# EAGLE schematic borrador_1 (EAGLE 9.5.2)

## Sheet 1 of 2
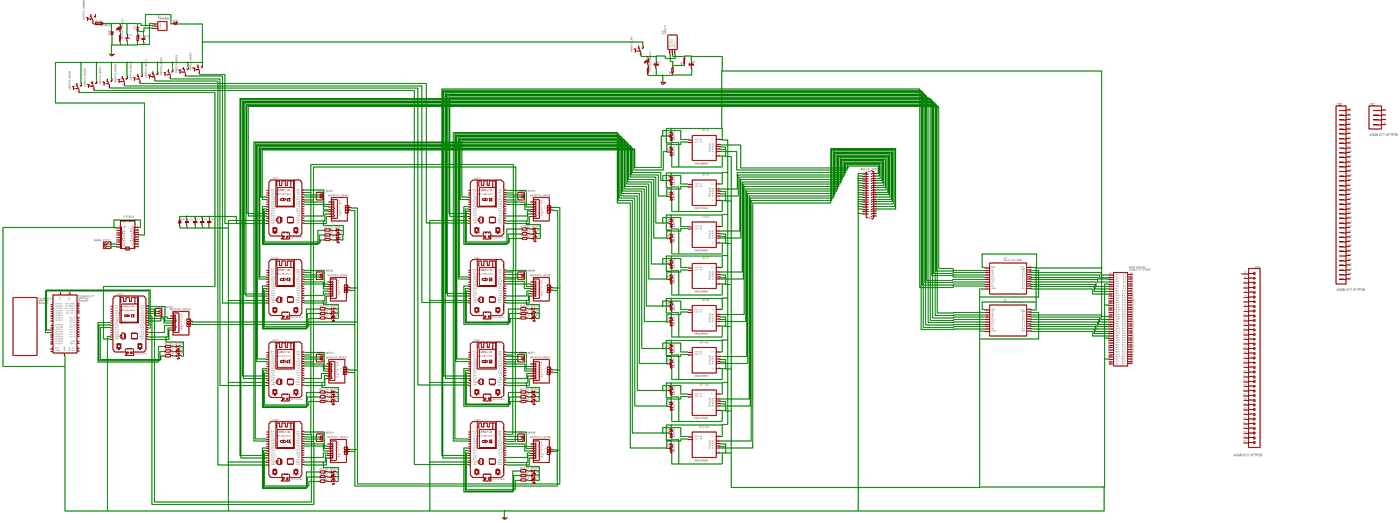
[diagram p0: schematic, sheet 1, overview]
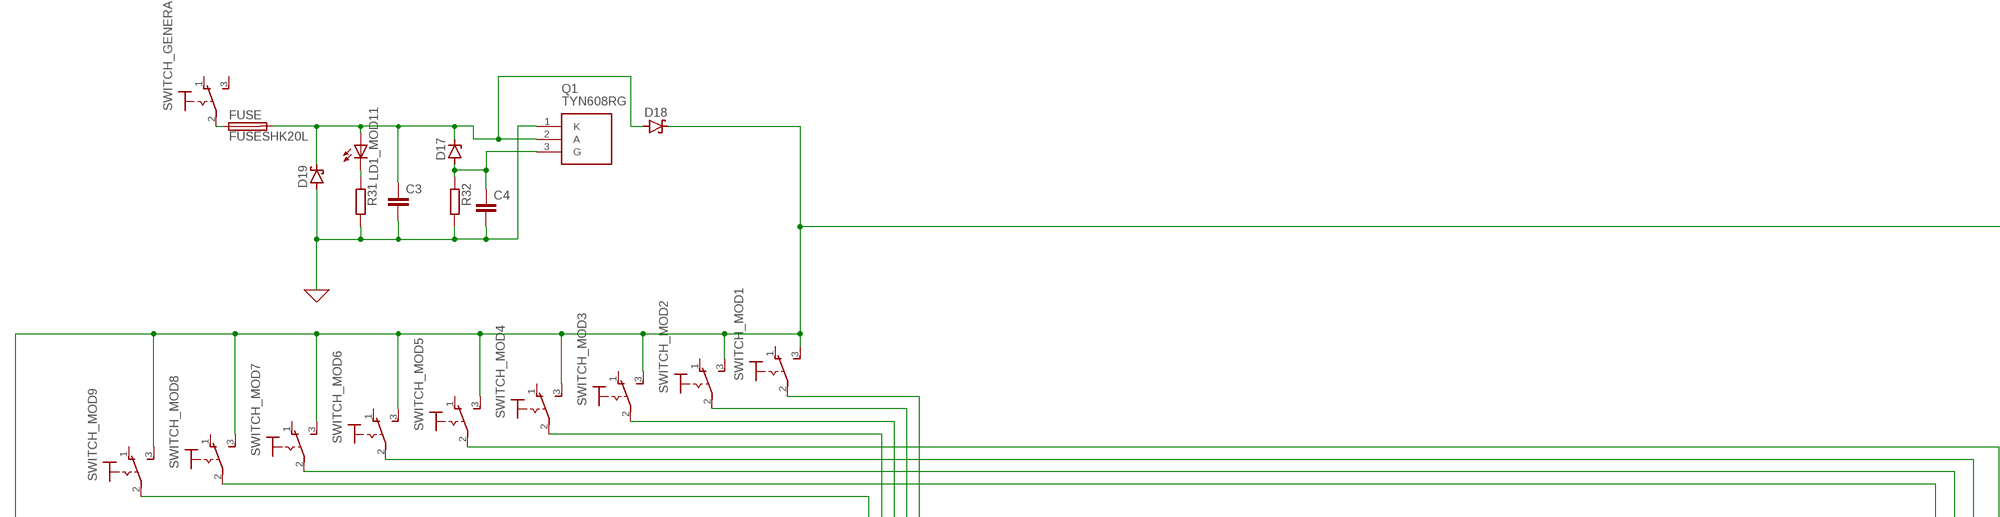
[diagram p1: schematic, sheet 1, part 1 of 9]
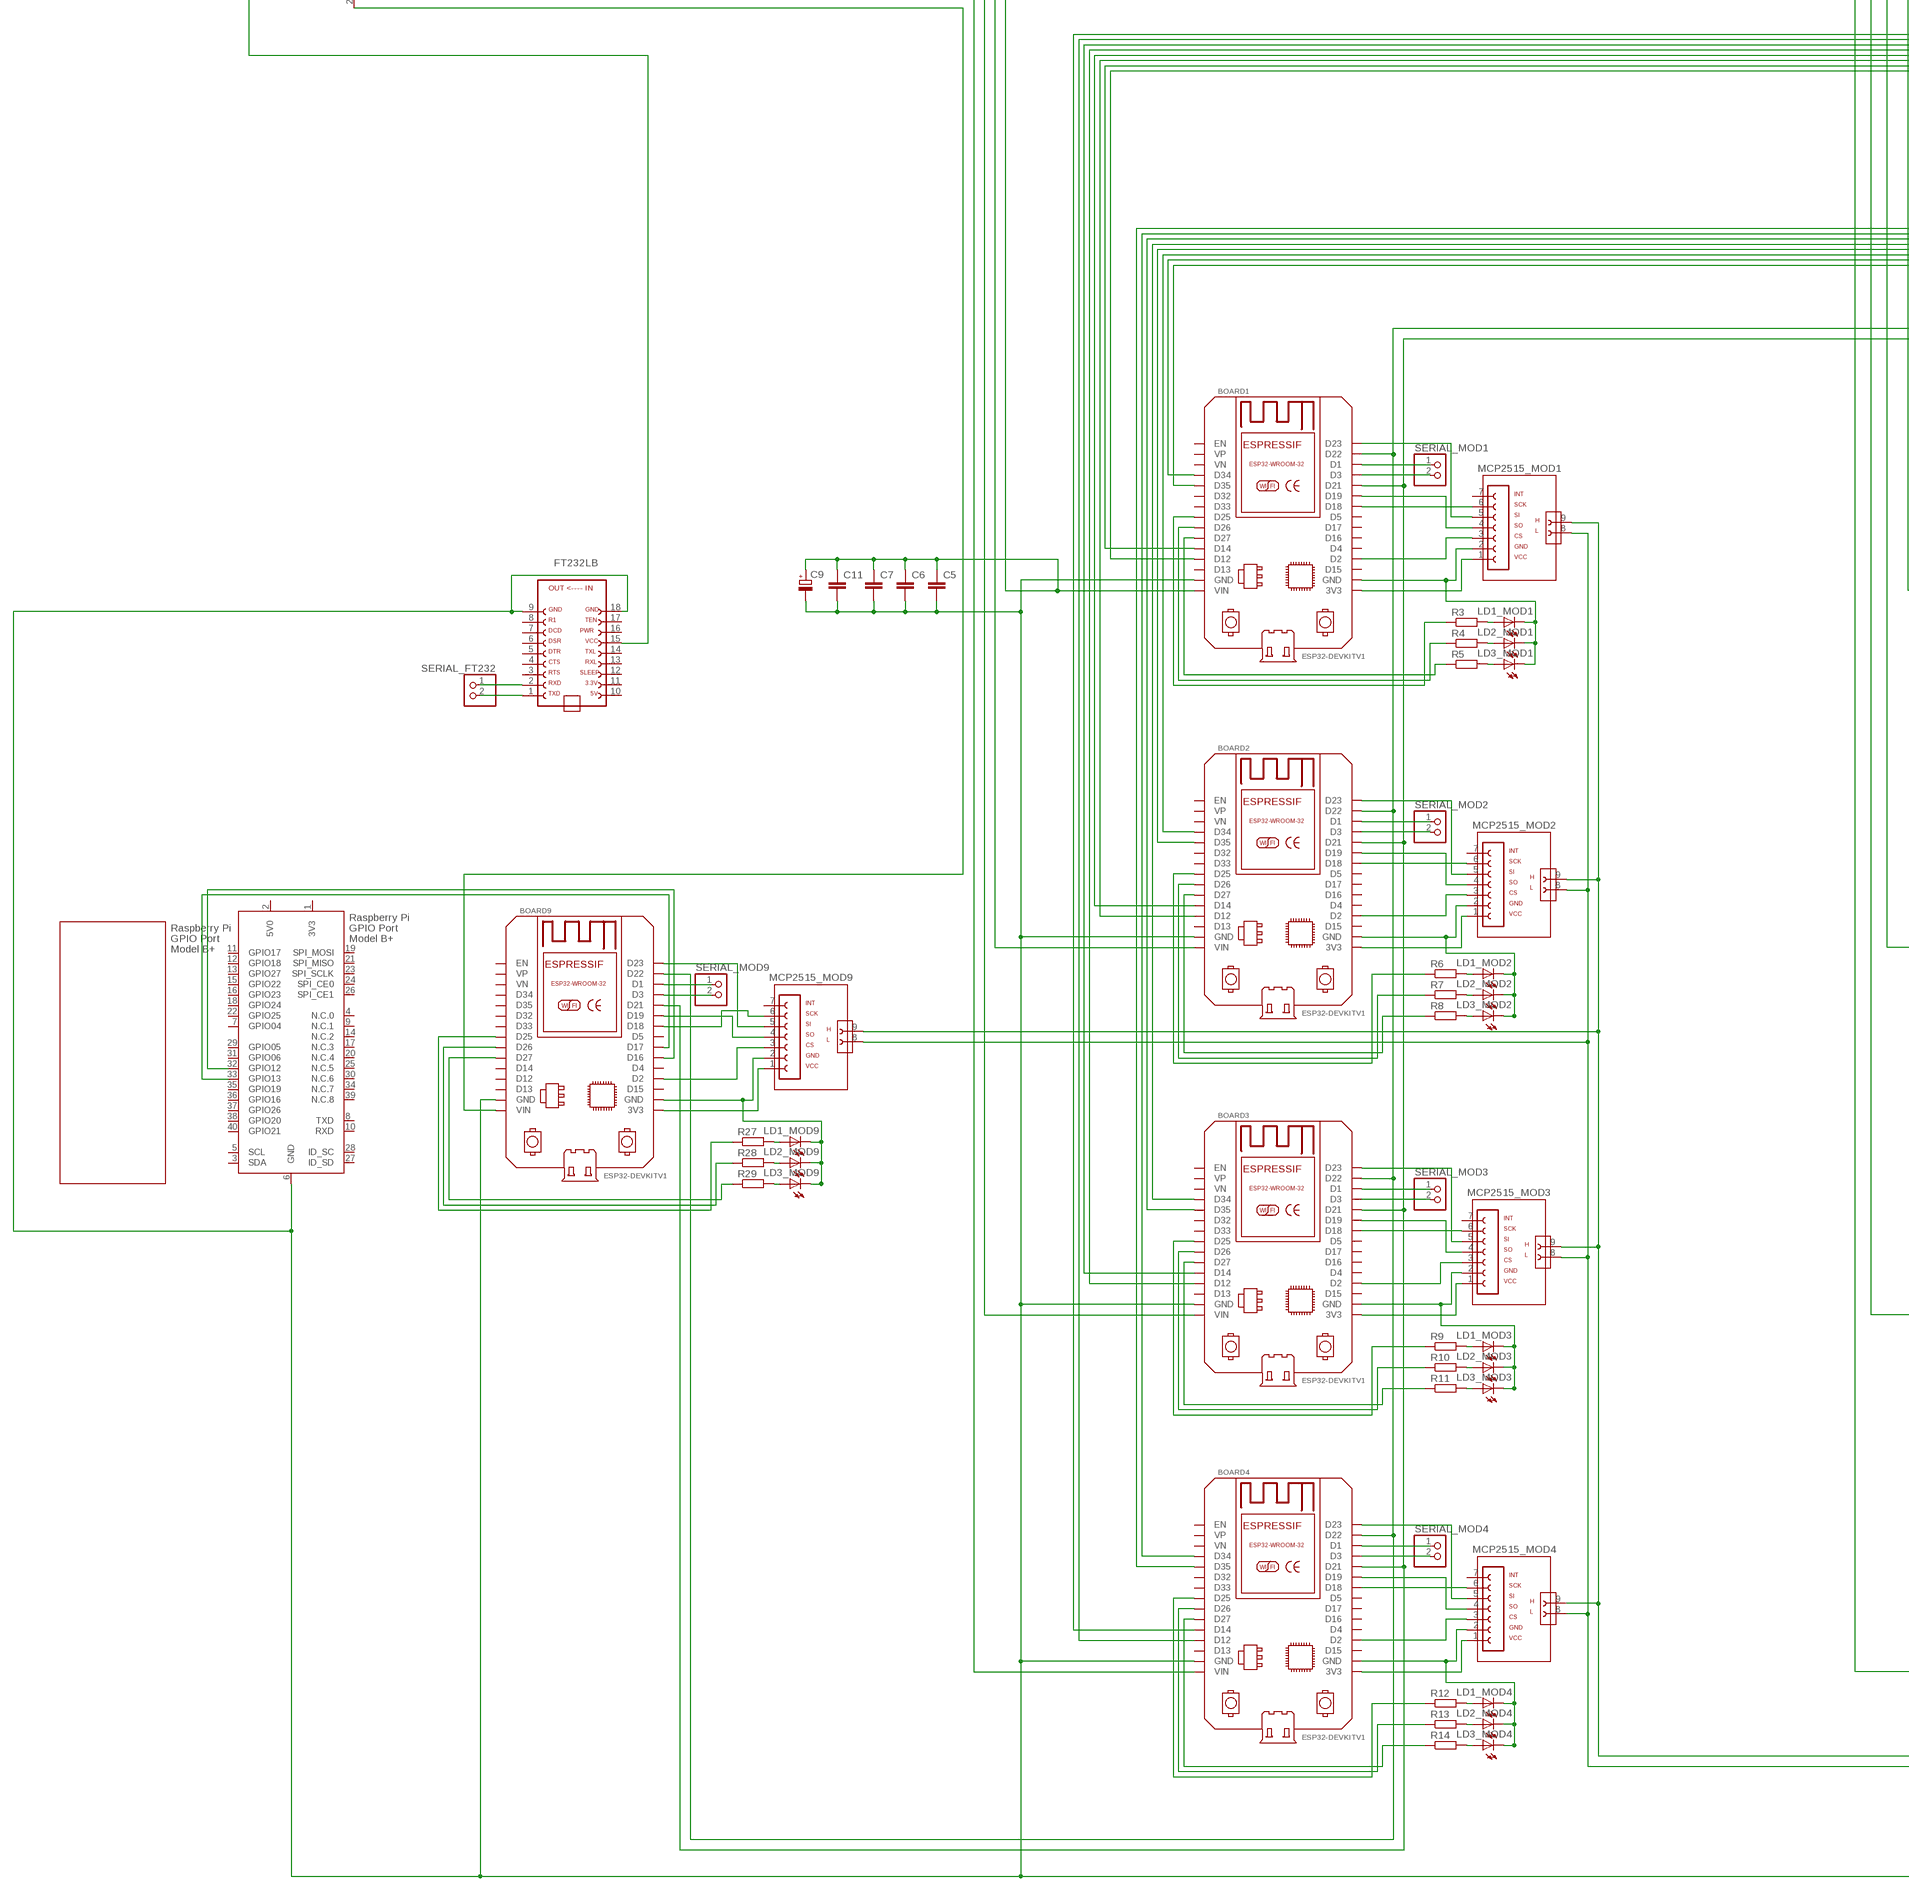
[diagram p2: schematic, sheet 1, part 2 of 9]
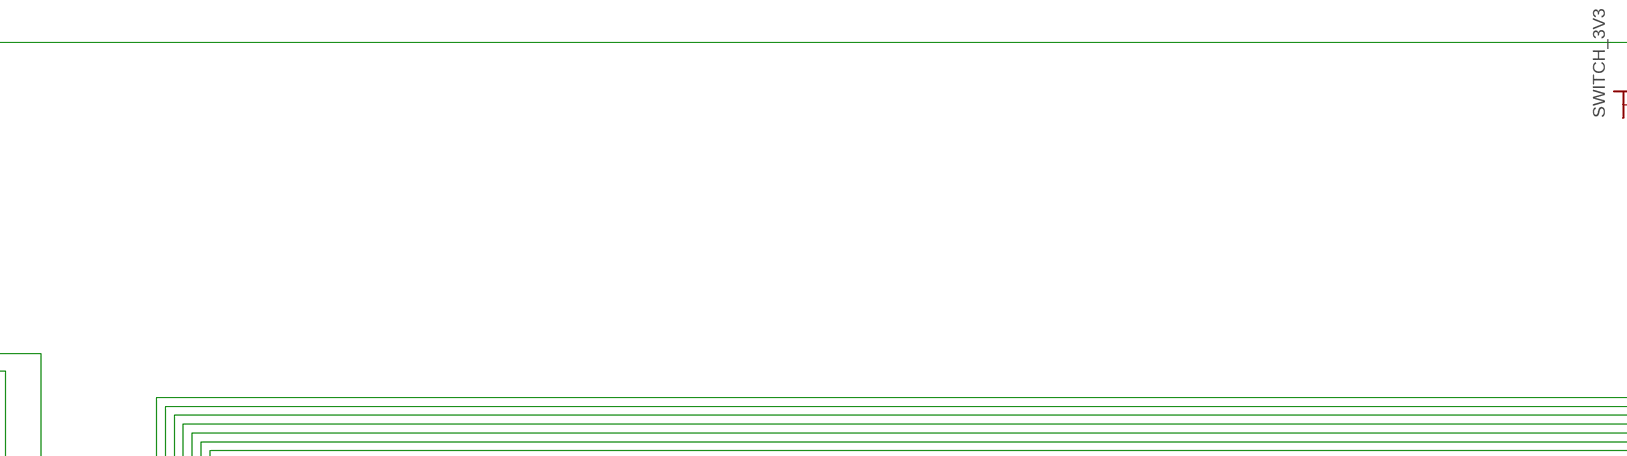
[diagram p3: schematic, sheet 1, part 3 of 9]
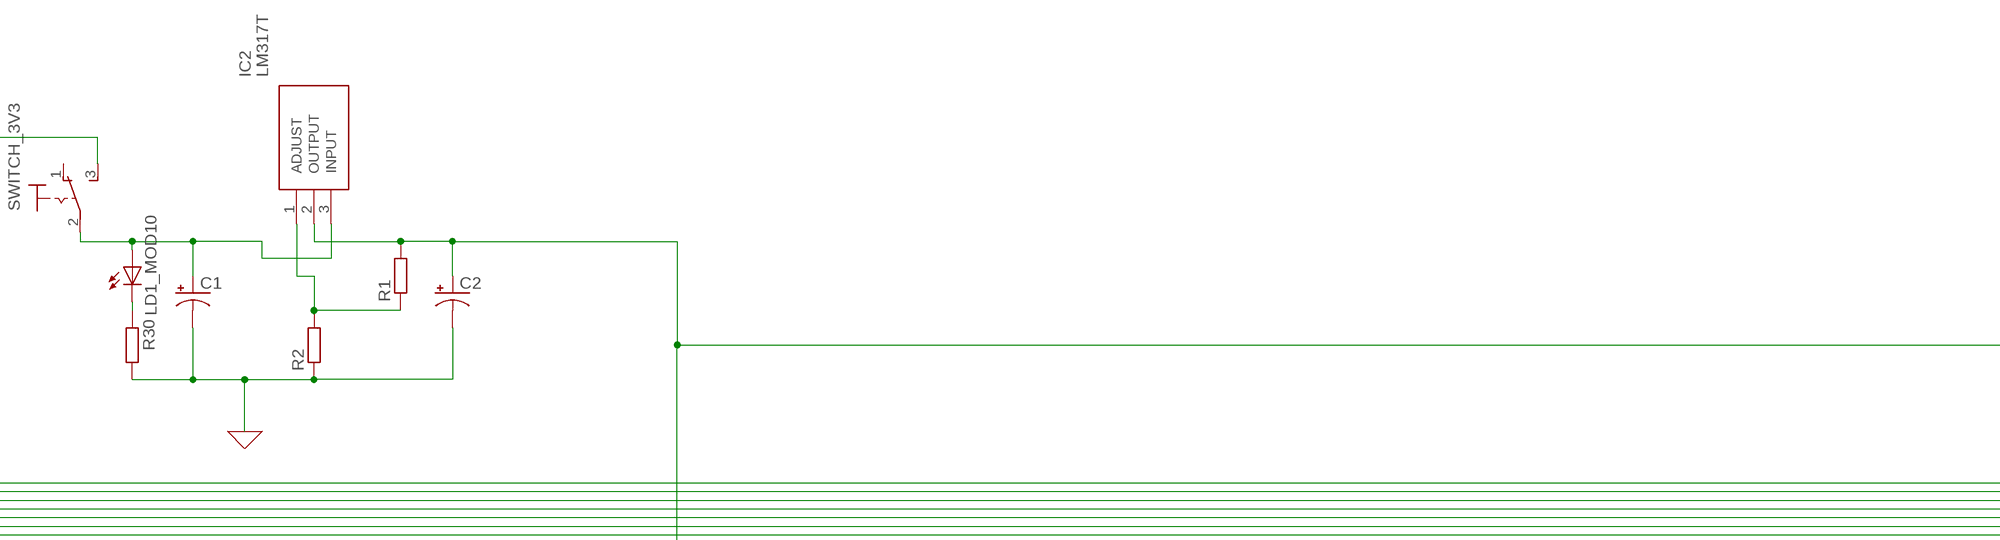
[diagram p4: schematic, sheet 1, part 4 of 9]
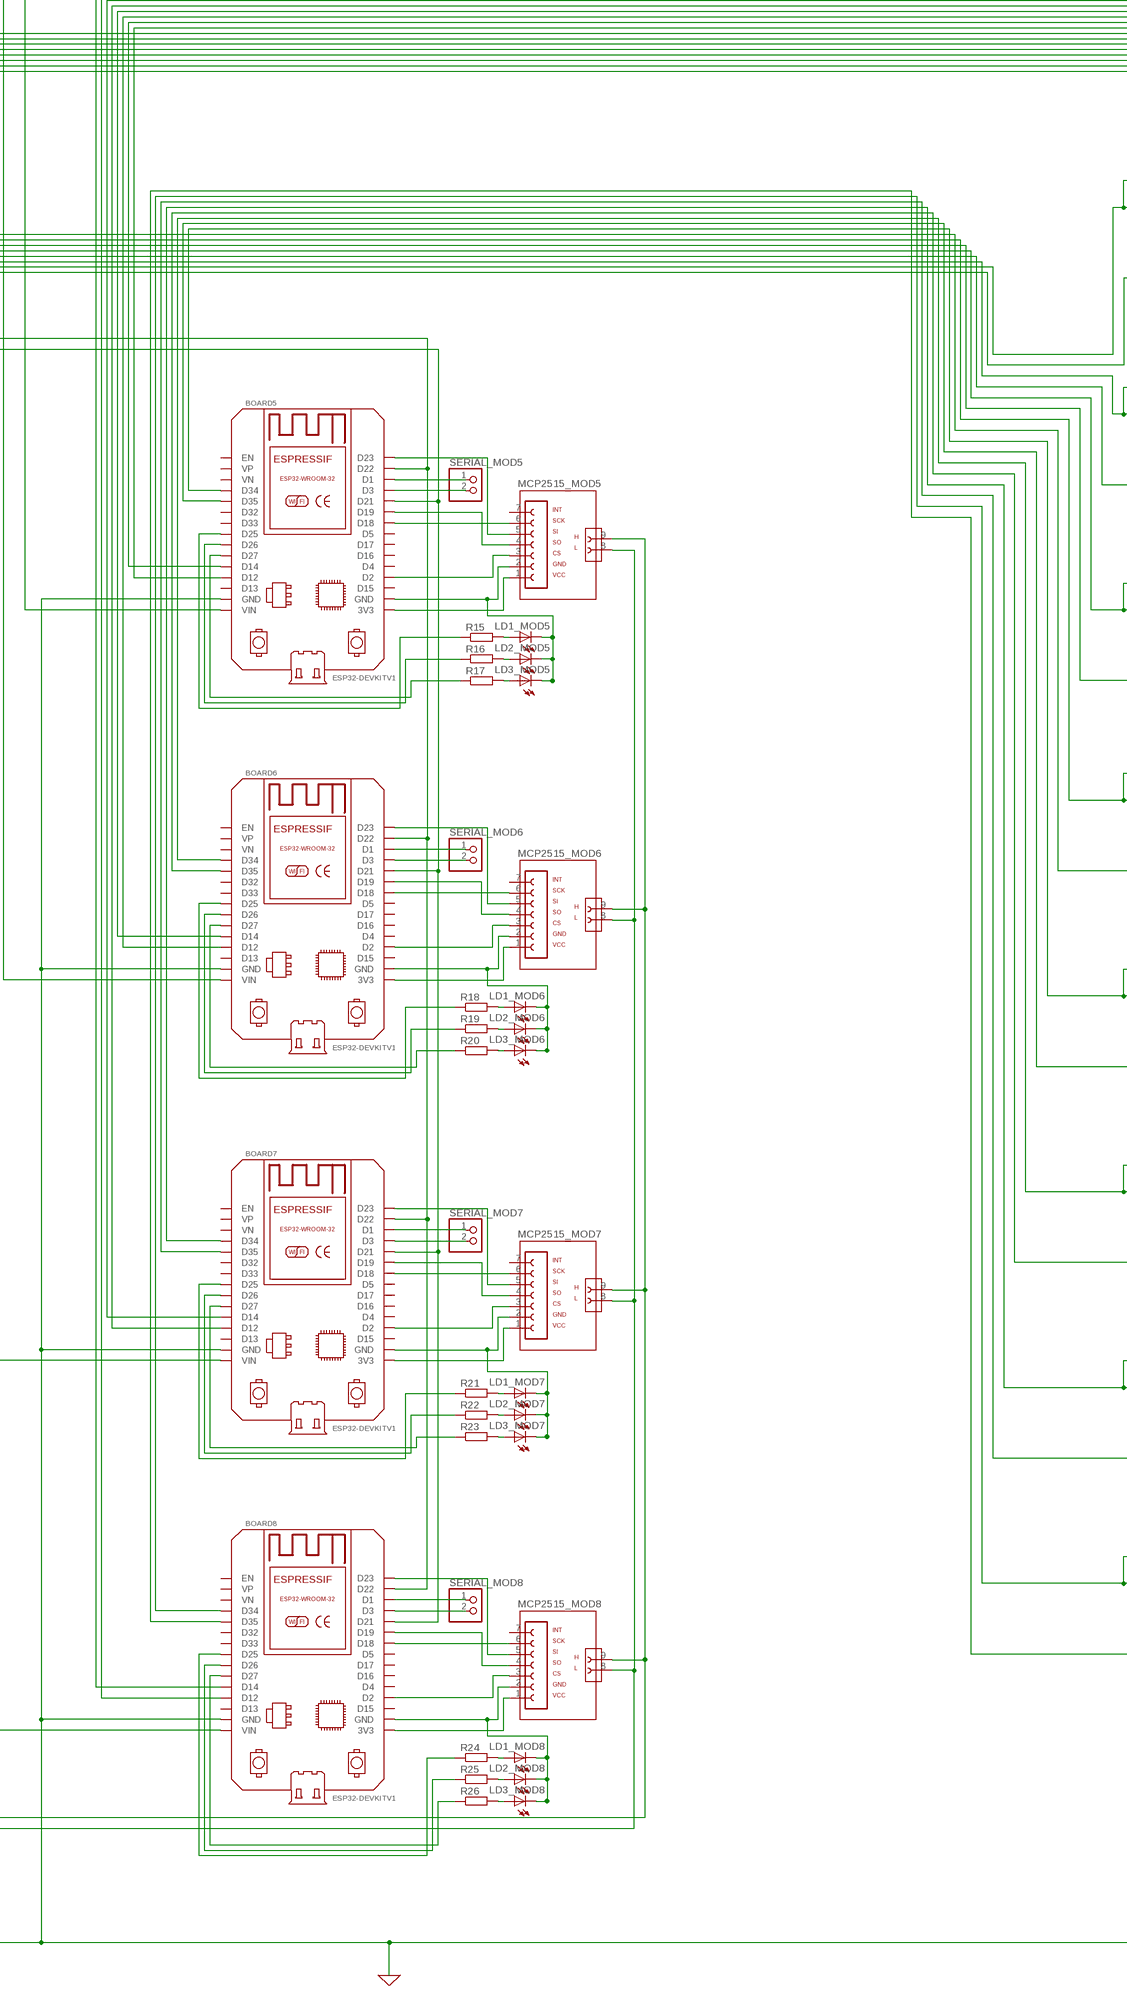
[diagram p5: schematic, sheet 1, part 5 of 9]
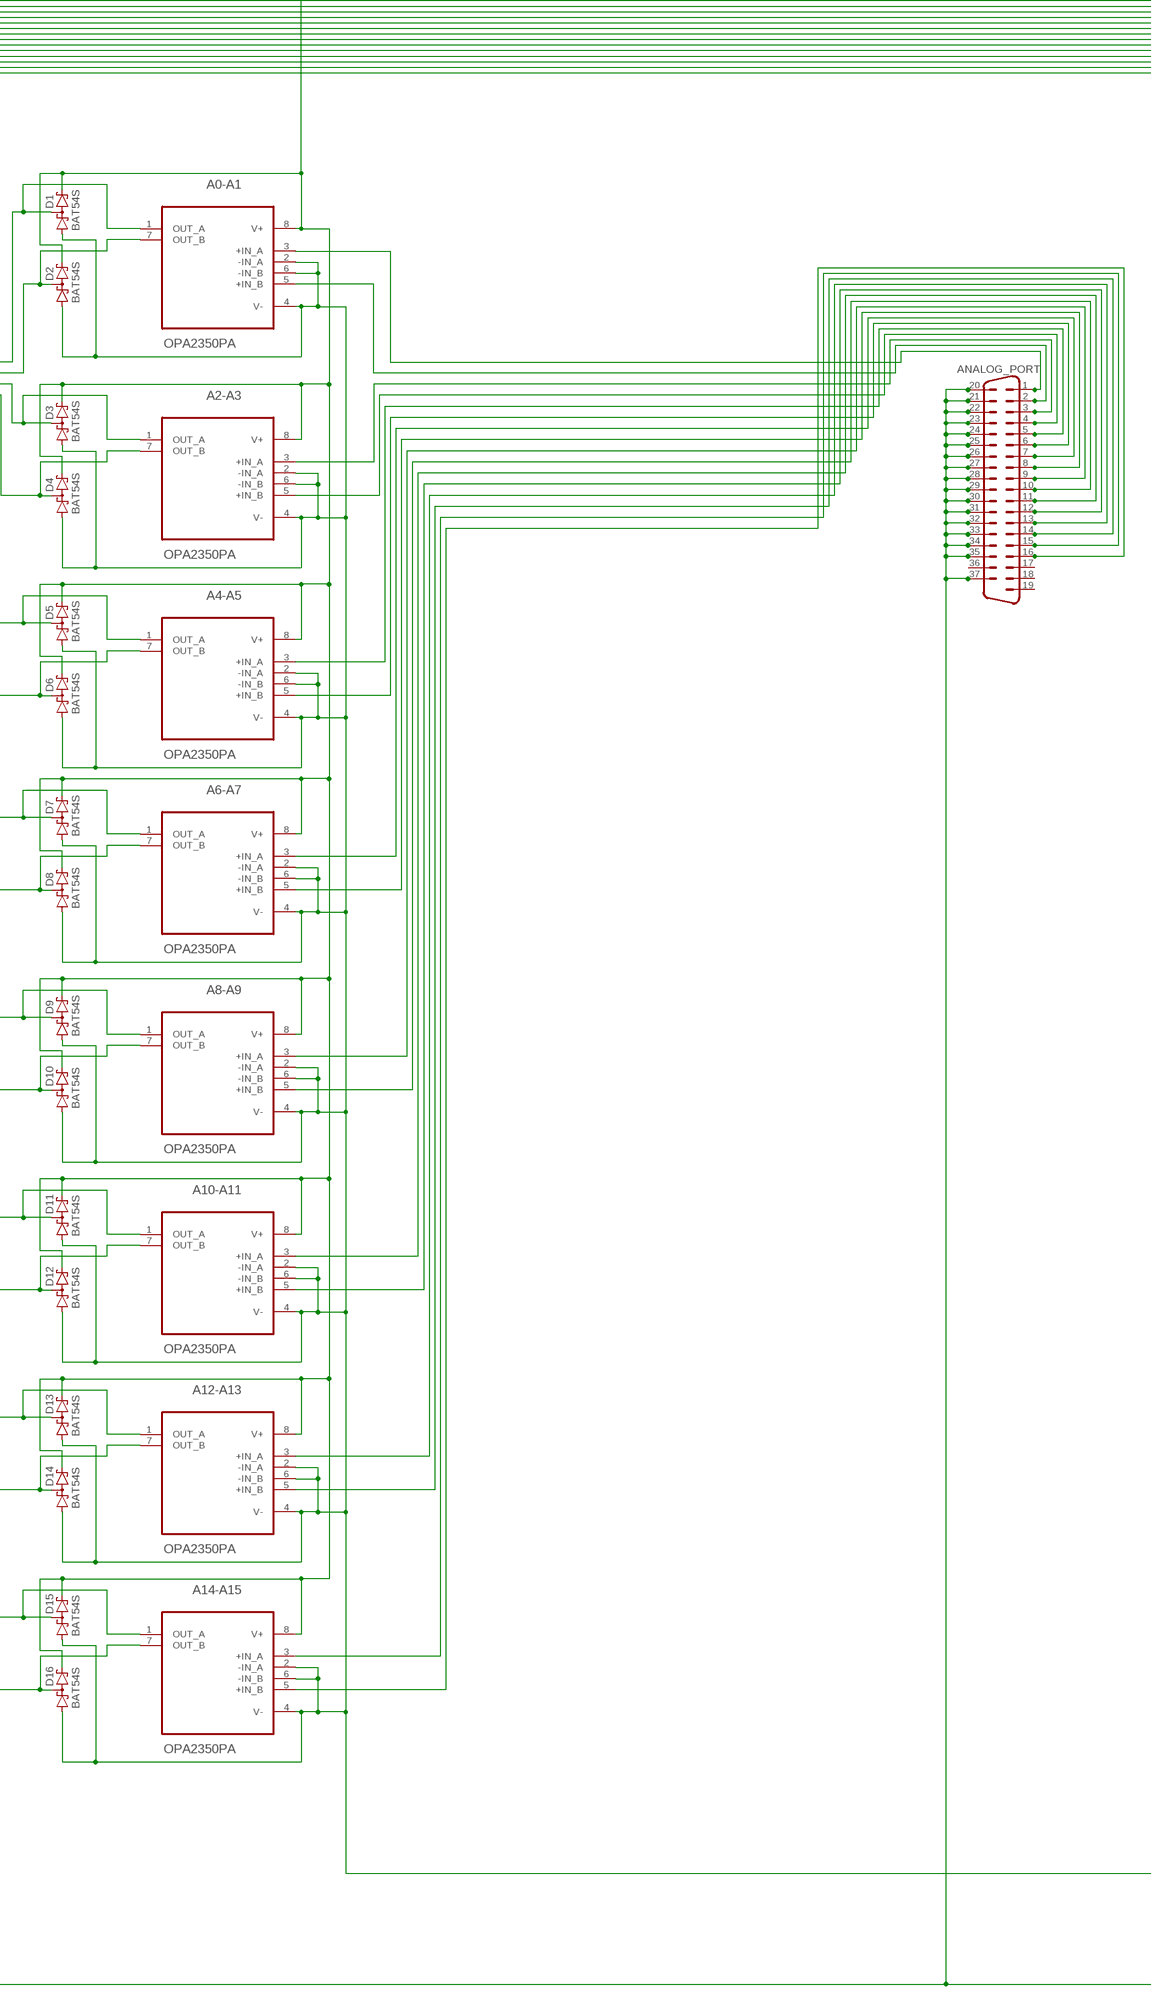
[diagram p6: schematic, sheet 1, part 6 of 9]
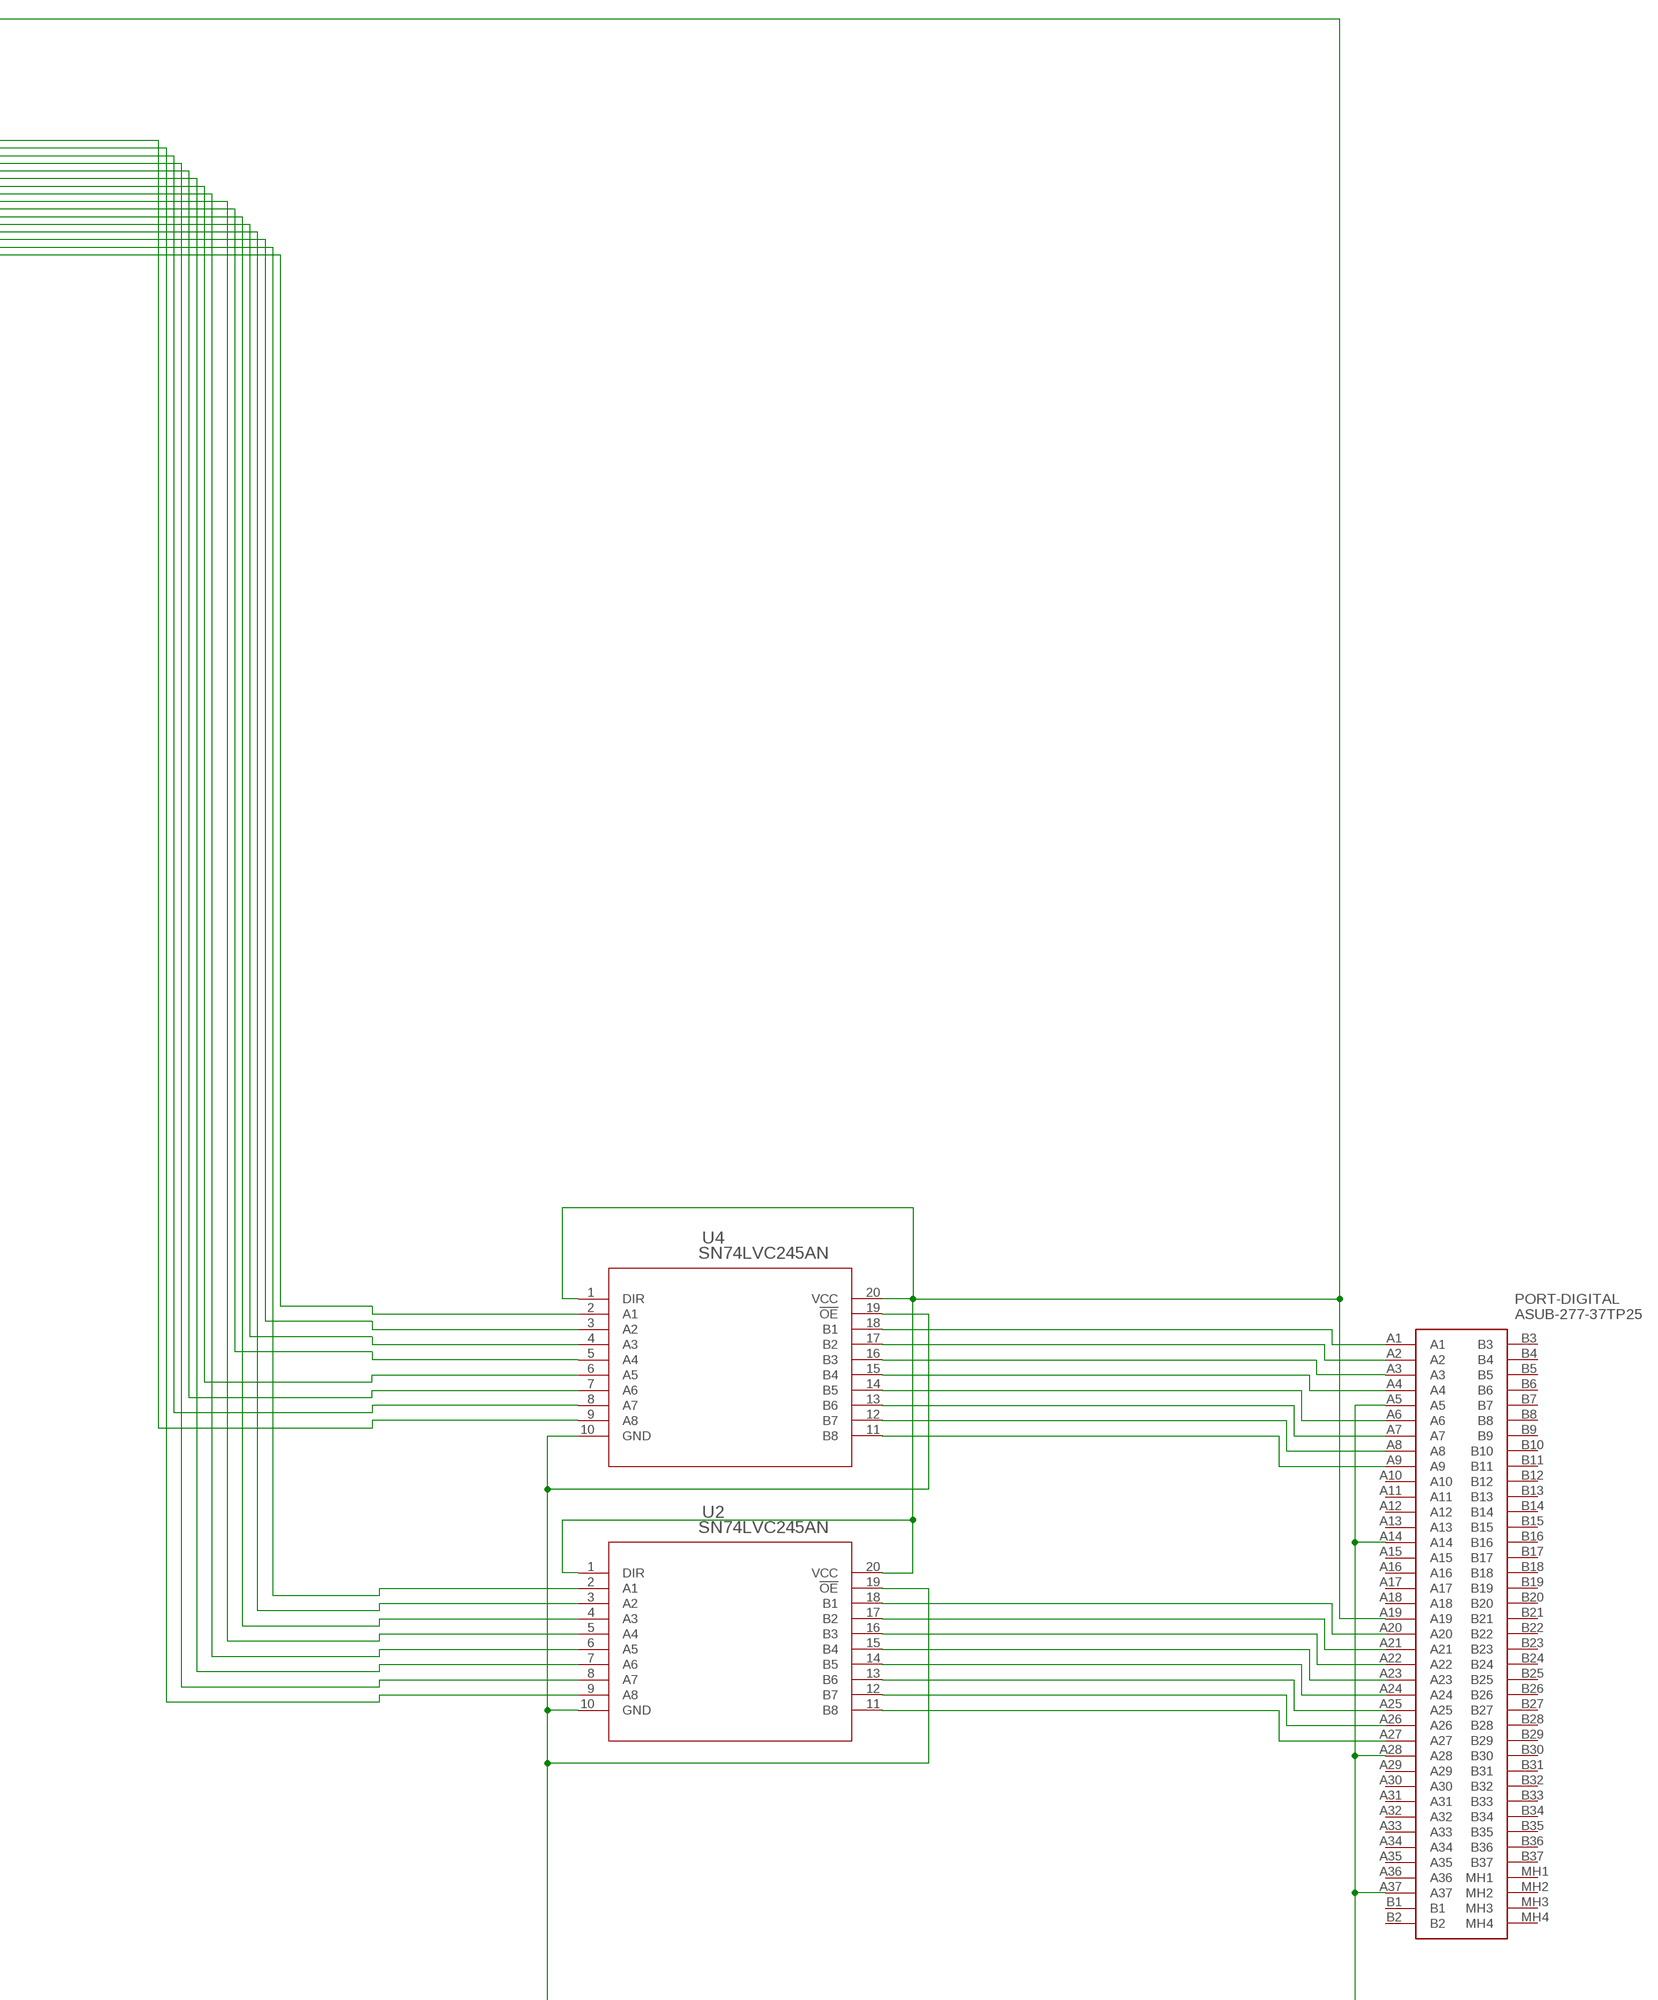
[diagram p7: schematic, sheet 1, part 7 of 9]
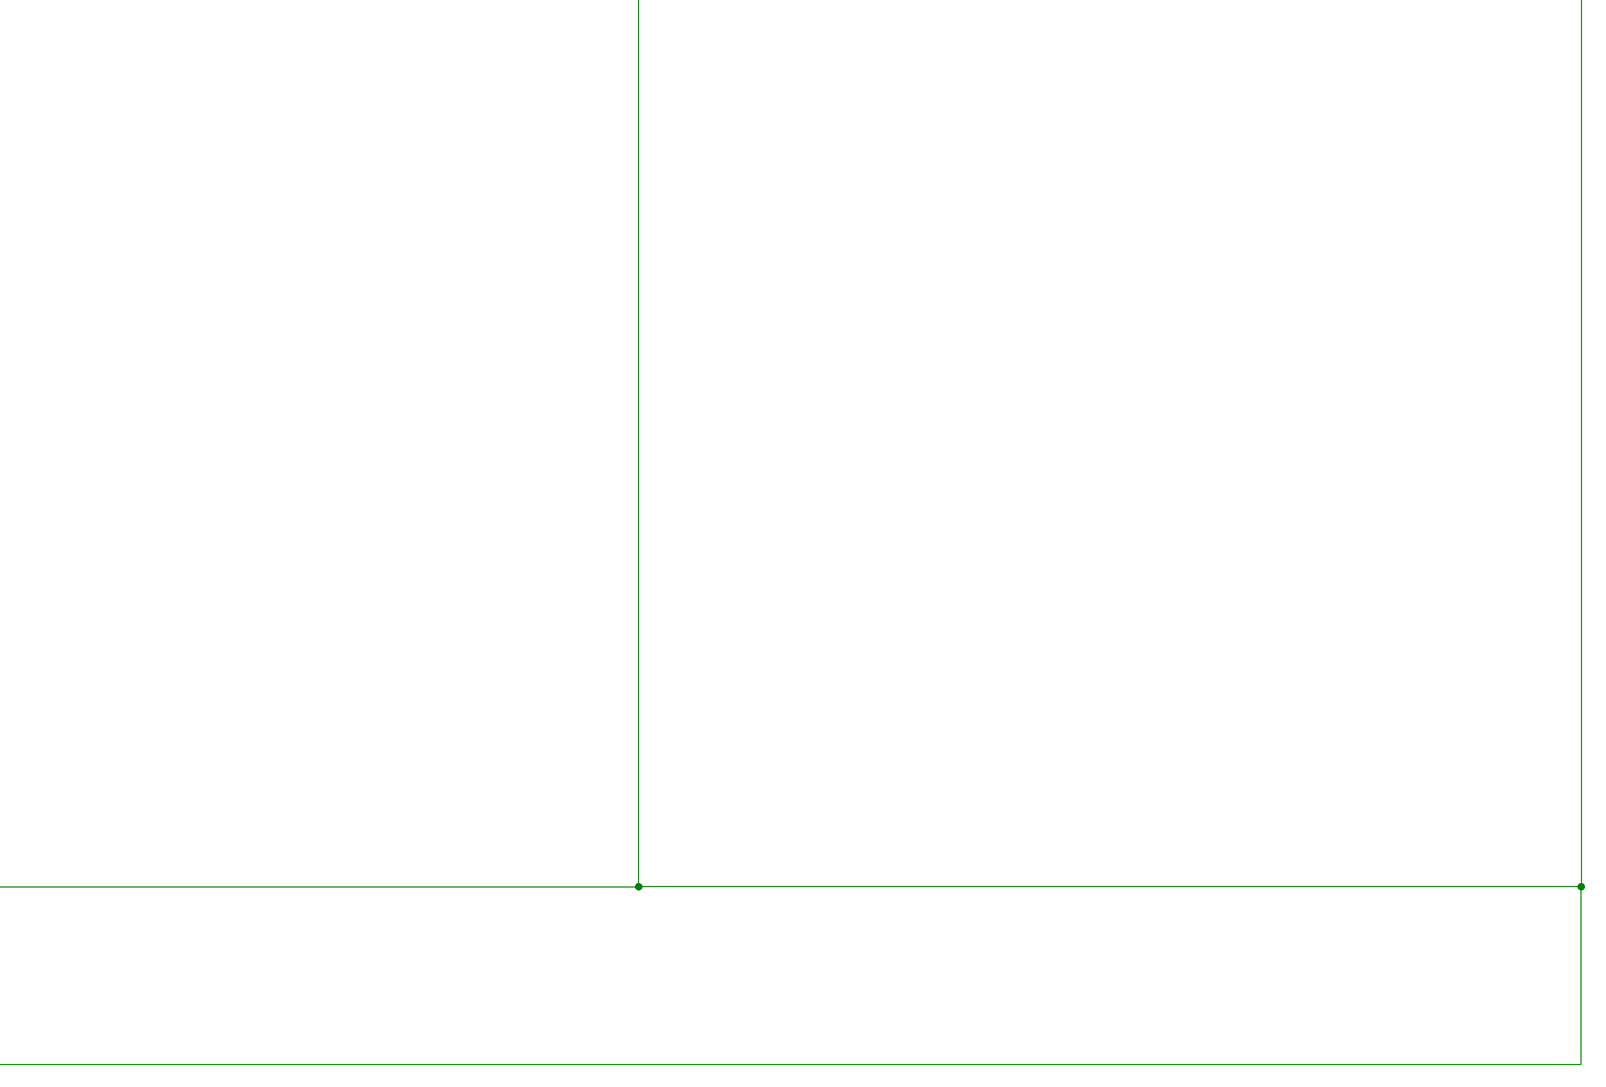
[diagram p8: schematic, sheet 1, part 8 of 9]
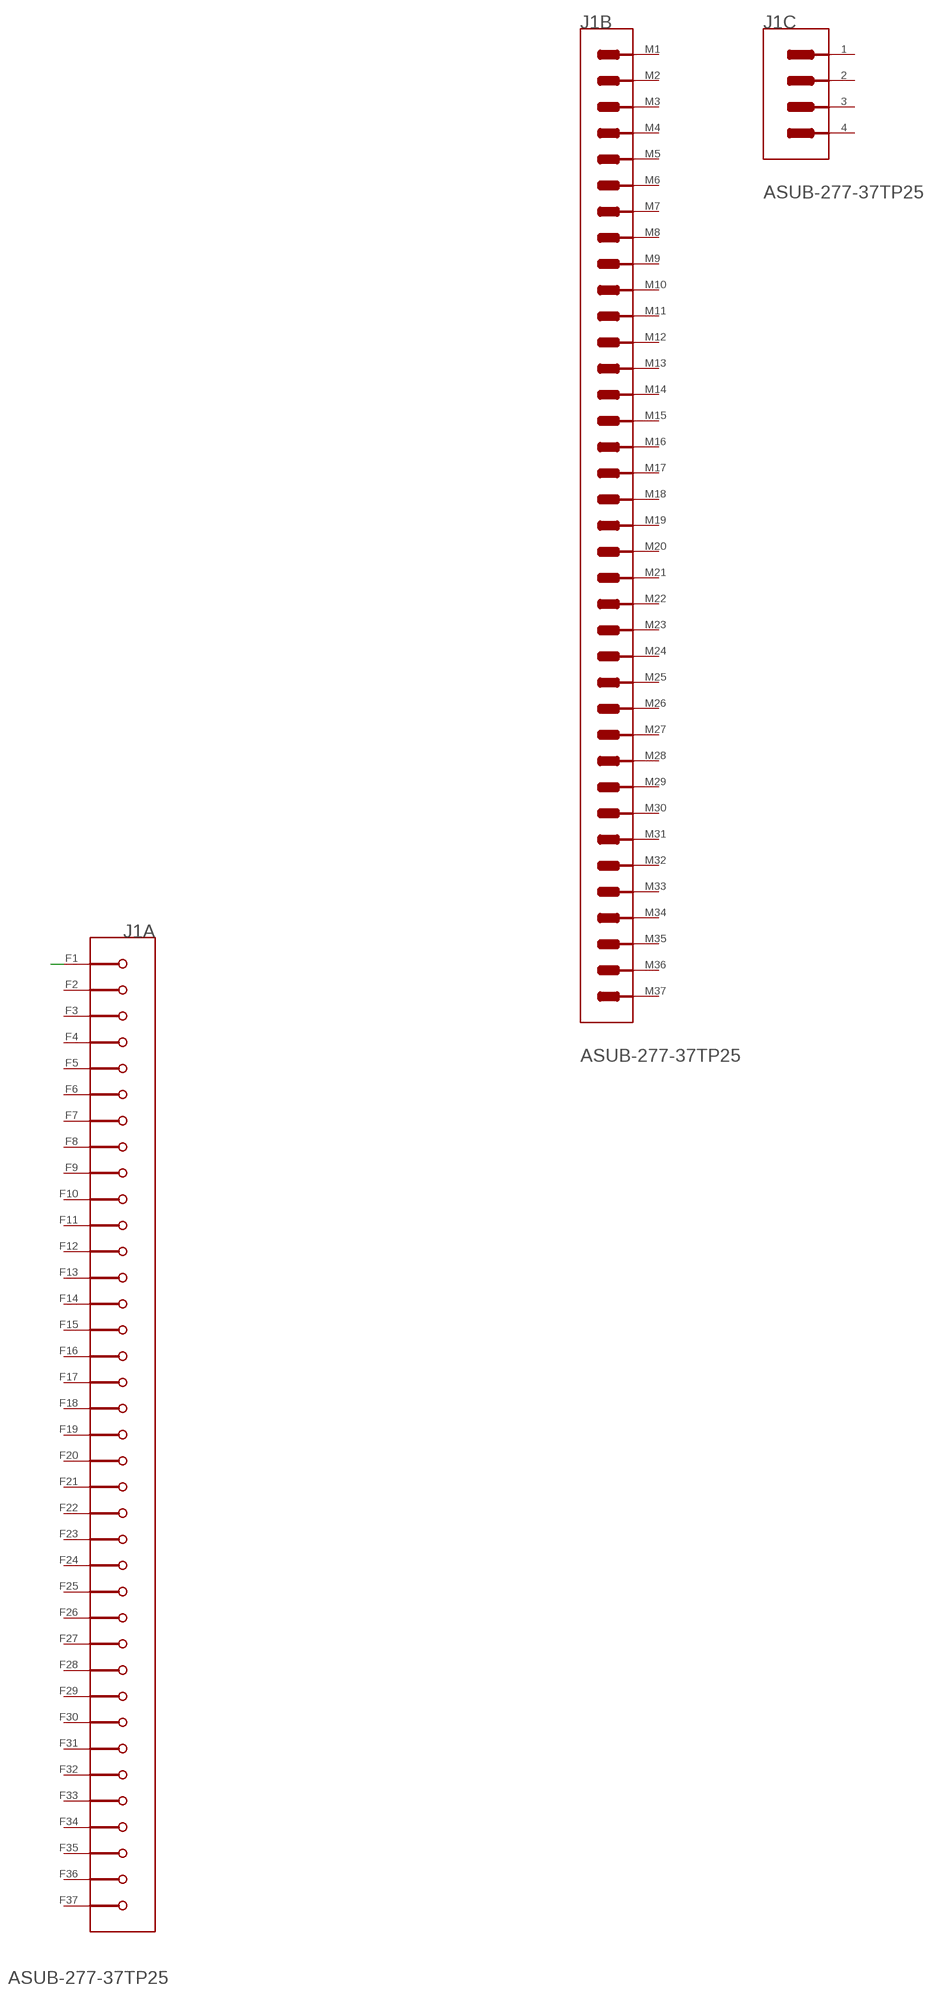
[diagram p9: schematic, sheet 1, part 9 of 9]

### Parts
A0-A1  OPA2350PA  [DIP254P762X508-8]
A2-A3  OPA2350PA  [DIP254P762X508-8]
A4-A5  OPA2350PA  [DIP254P762X508-8]
A6-A7  OPA2350PA  [DIP254P762X508-8]
A8-A9  OPA2350PA  [DIP254P762X508-8]
A10-A11  OPA2350PA  [DIP254P762X508-8]
A12-A13  OPA2350PA  [DIP254P762X508-8]
A14-A15  OPA2350PA  [DIP254P762X508-8]
ANALOG_PORT  M37HP  [M37HP]
BOARD1  ESP32DEVKITV1  [ESP32-DEVKITV1]
BOARD2  ESP32DEVKITV1  [ESP32-DEVKITV1]
BOARD3  ESP32DEVKITV1  [ESP32-DEVKITV1]
BOARD4  ESP32DEVKITV1  [ESP32-DEVKITV1]
BOARD5  ESP32DEVKITV1  [ESP32-DEVKITV1]
BOARD6  ESP32DEVKITV1  [ESP32-DEVKITV1]
BOARD7  ESP32DEVKITV1  [ESP32-DEVKITV1]
BOARD8  ESP32DEVKITV1  [ESP32-DEVKITV1]
BOARD9  ESP32DEVKITV1  [ESP32-DEVKITV1]
C1  CPOL-USE2.5-6  [E2,5-6]
C2  CPOL-USE2.5-6  [E2,5-6]
C3  C-EU050-030X075  [C050-030X075]
C4  C-EU050-030X075  [C050-030X075]
C5  C2.5/2  [C2.5-2]
C6  C2.5/2  [C2.5-2]
C7  C-EU025-030X050  [C025-030X050]
C9  CPOL-EUE2.5-6  [E2,5-6]
C11  C-EU050-030X075  [C050-030X075]
D1  BAT54S  [SOT23]
D2  BAT54S  [SOT23]
D3  BAT54S  [SOT23]
D4  BAT54S  [SOT23]
D5  BAT54S  [SOT23]
D6  BAT54S  [SOT23]
D7  BAT54S  [SOT23]
D8  BAT54S  [SOT23]
D9  BAT54S  [SOT23]
D10  BAT54S  [SOT23]
D11  BAT54S  [SOT23]
D12  BAT54S  [SOT23]
D13  BAT54S  [SOT23]
D14  BAT54S  [SOT23]
D15  BAT54S  [SOT23]
D16  BAT54S  [SOT23]
D17  ZENER-DIODEDO41Z10  [DO41Z10]
D18  SCHOTTKY-DIODECB429-15  [CB429-15]
D19  SCHOTTKY-DIODECB429-15  [CB429-15]
FT232LB  FT232BL  [FT232BL]
FUSE  FUSESHK20L  [SHK20L]
IC2  LM317T  [TO255P460X1020X2008-3P]
J1  ASSMANN_WSW_COMPONENTS_ASUB-277-37TP25ASSMANN_WSW_COMPONENTS_ASUB-277-37TP25_0_0  [ASSMANN_WSW_COMPONENTS_ASUB-277-37TP25_0]
LD1_MOD1  LED3MM  [LED3MM]
LD1_MOD2  LED3MM  [LED3MM]
LD1_MOD3  LED3MM  [LED3MM]
LD1_MOD4  LED3MM  [LED3MM]
LD1_MOD5  LED3MM  [LED3MM]
LD1_MOD6  LED3MM  [LED3MM]
LD1_MOD7  LED3MM  [LED3MM]
LD1_MOD8  LED3MM  [LED3MM]
LD1_MOD9  LED3MM  [LED3MM]
LD1_MOD10  LED3MM  [LED3MM]
LD1_MOD11  LED3MM  [LED3MM]
LD2_MOD1  LED3MM  [LED3MM]
LD2_MOD2  LED3MM  [LED3MM]
LD2_MOD3  LED3MM  [LED3MM]
LD2_MOD4  LED3MM  [LED3MM]
LD2_MOD5  LED3MM  [LED3MM]
LD2_MOD6  LED3MM  [LED3MM]
LD2_MOD7  LED3MM  [LED3MM]
LD2_MOD8  LED3MM  [LED3MM]
LD2_MOD9  LED3MM  [LED3MM]
LD3_MOD1  LED3MM  [LED3MM]
LD3_MOD2  LED3MM  [LED3MM]
LD3_MOD3  LED3MM  [LED3MM]
LD3_MOD4  LED3MM  [LED3MM]
LD3_MOD5  LED3MM  [LED3MM]
LD3_MOD6  LED3MM  [LED3MM]
LD3_MOD7  LED3MM  [LED3MM]
LD3_MOD8  LED3MM  [LED3MM]
LD3_MOD9  LED3MM  [LED3MM]
MCP2515_MOD1  MCP2515  [MCP2515]
MCP2515_MOD2  MCP2515  [MCP2515]
MCP2515_MOD3  MCP2515  [MCP2515]
MCP2515_MOD4  MCP2515  [MCP2515]
MCP2515_MOD5  MCP2515  [MCP2515]
MCP2515_MOD6  MCP2515  [MCP2515]
MCP2515_MOD7  MCP2515  [MCP2515]
MCP2515_MOD8  MCP2515  [MCP2515]
MCP2515_MOD9  MCP2515  [MCP2515]
PORT-DIGITAL  ASUB-277-37TP25  [ASUB27737TP25]
Q1  TYN608RG  [TO270P460X1020X2008-3P]
R1  R-EU_0411/15  [0411/15]
R2  R-EU_0411/15  [0411/15]
R3  R-EU_0207/10  [0207/10]
R4  R-EU_0207/10  [0207/10]
R5  R-EU_0207/10  [0207/10]
R6  R-EU_0207/10  [0207/10]
R7  R-EU_0207/10  [0207/10]
R8  R-EU_0207/10  [0207/10]
R9  R-EU_0207/10  [0207/10]
R10  R-EU_0207/10  [0207/10]
R11  R-EU_0207/10  [0207/10]
R12  R-EU_0207/10  [0207/10]
R13  R-EU_0207/10  [0207/10]
R14  R-EU_0207/10  [0207/10]
R15  R-EU_0207/10  [0207/10]
R16  R-EU_0207/10  [0207/10]
R17  R-EU_0207/10  [0207/10]
R18  R-EU_0207/10  [0207/10]
R19  R-EU_0207/10  [0207/10]
R20  R-EU_0207/10  [0207/10]
R21  R-EU_0207/10  [0207/10]
R22  R-EU_0207/10  [0207/10]
R23  R-EU_0207/10  [0207/10]
R24  R-EU_0207/10  [0207/10]
R25  R-EU_0207/10  [0207/10]
R26  R-EU_0207/10  [0207/10]
R27  R-EU_0207/10  [0207/10]
R28  R-EU_0207/10  [0207/10]
R29  R-EU_0207/10  [0207/10]
R30  R-EU_0207/10  [0207/10]
R31  R-EU_0207/10  [0207/10]
R32  R-EU_0207/10  [0207/10]
SERIAL_FT232  PINHD-1X2  [1X02]
SERIAL_MOD1  PINHD-1X2  [1X02]
SERIAL_MOD2  PINHD-1X2  [1X02]
SERIAL_MOD3  PINHD-1X2  [1X02]
SERIAL_MOD4  PINHD-1X2  [1X02]
SERIAL_MOD5  PINHD-1X2  [1X02]
SERIAL_MOD6  PINHD-1X2  [1X02]
SERIAL_MOD7  PINHD-1X2  [1X02]
SERIAL_MOD8  PINHD-1X2  [1X02]
SERIAL_MOD9  PINHD-1X2  [1X02]
SWITCH_3V3  M9040P  [M9040P]
SWITCH_GENERAL  M9040P  [M9040P]
SWITCH_MOD1  M9040P  [M9040P]
SWITCH_MOD2  M9040P  [M9040P]
SWITCH_MOD3  M9040P  [M9040P]
SWITCH_MOD4  M9040P  [M9040P]
SWITCH_MOD5  M9040P  [M9040P]
SWITCH_MOD6  M9040P  [M9040P]
SWITCH_MOD7  M9040P  [M9040P]
SWITCH_MOD8  M9040P  [M9040P]
SWITCH_MOD9  M9040P  [M9040P]
U2  SN74LVC245AN  [N20]
U4  SN74LVC245AN  [N20]
X1  RASPI_GPIO_B+_BOX  [RASPI_GPIO_B+_BOX]
X2  RASPI_BOARD_B+#_F  [RASPI_BOARD_B+_FULL]

### Nets
5V: D18.C FT232LB.15 SWITCH_3V3.3(S) SWITCH_MOD1.3(S) SWITCH_MOD2.3(S) SWITCH_MOD3.3(S) SWITCH_MOD4.3(S) SWITCH_MOD5.3(S) SWITCH_MOD6.3(S) SWITCH_MOD7.3(S) SWITCH_MOD8.3(S) SWITCH_MOD9.3(S)
5V_MOD1: BOARD1.VIN C5.1 C6.1 C7.1 C9.+ C11.1 SWITCH_MOD1.2(P)
5V_MOD2: BOARD2.VIN SWITCH_MOD2.2(P)
5V_MOD3: BOARD3.VIN SWITCH_MOD3.2(P)
5V_MOD4: BOARD4.VIN SWITCH_MOD4.2(P)
5V_MOD5: BOARD5.VIN SWITCH_MOD5.2(P)
5V_MOD6: BOARD6.VIN SWITCH_MOD6.2(P)
5V_MOD7: BOARD7.VIN SWITCH_MOD7.2(P)
5V_MOD8: BOARD8.VIN SWITCH_MOD8.2(P)
5V_MOD9: BOARD9.VIN SWITCH_MOD9.2(P)
CAN_H: MCP2515_MOD1.9 MCP2515_MOD2.9 MCP2515_MOD3.9 MCP2515_MOD4.9 MCP2515_MOD5.9 MCP2515_MOD6.9 MCP2515_MOD7.9 MCP2515_MOD8.9 MCP2515_MOD9.9
CAN_L: MCP2515_MOD1.8 MCP2515_MOD2.8 MCP2515_MOD3.8 MCP2515_MOD4.8 MCP2515_MOD5.8 MCP2515_MOD6.8 MCP2515_MOD7.8 MCP2515_MOD8.8 MCP2515_MOD9.8
GND_MOD1: BOARD1.GND@1(GND) LD1_MOD1.K(C) LD2_MOD1.K(C) LD3_MOD1.K(C) MCP2515_MOD1.2
GND_MOD2: BOARD2.GND@1(GND) LD1_MOD2.K(C) LD2_MOD2.K(C) LD3_MOD2.K(C) MCP2515_MOD2.2
GND_MOD3: BOARD3.GND@1(GND) LD1_MOD3.K(C) LD2_MOD3.K(C) LD3_MOD3.K(C) MCP2515_MOD3.2
GND_MOD4: BOARD4.GND@1(GND) LD1_MOD4.K(C) LD2_MOD4.K(C) LD3_MOD4.K(C) MCP2515_MOD4.2
GND_MOD5: BOARD5.GND@1(GND) LD1_MOD5.K(C) LD2_MOD5.K(C) LD3_MOD5.K(C) MCP2515_MOD5.2
GND_MOD6: BOARD6.GND@1(GND) LD1_MOD6.K(C) LD2_MOD6.K(C) LD3_MOD6.K(C) MCP2515_MOD6.2
GND_MOD7: BOARD7.GND@1(GND) LD1_MOD7.K(C) LD2_MOD7.K(C) LD3_MOD7.K(C) MCP2515_MOD7.2
GND_MOD8: BOARD8.GND@1(GND) LD1_MOD8.K(C) LD2_MOD8.K(C) LD3_MOD8.K(C) MCP2515_MOD8.2
GND_MOD9: BOARD9.GND@1(GND) LD1_MOD9.K(C) LD2_MOD9.K(C) LD3_MOD9.K(C) MCP2515_MOD9.2
L_3V3: A0-A1.8(V+) A2-A3.8(V+) A4-A5.8(V+) A6-A7.8(V+) A8-A9.8(V+) A10-A11.8(V+) A12-A13.8(V+) A14-A15.8(V+) C2.+ D1.2(C2) D2.2(C2) D3.2(C2) D4.2(C2) D5.2(C2) D6.2(C2) D7.2(C2) D8.2(C2) D9.2(C2) D10.2(C2) D11.2(C2) D12.2(C2) D13.2(C2) D14.2(C2) D15.2(C2) D16.2(C2) IC2.2(OUTPUT) PORT-DIGITAL.A19 R1.2 U2.1(DIR) U2.20(VCC) U4.1(DIR) U4.20(VCC)
L_AO_0: A0-A1.1(OUT_A) BOARD1.D34 D1.3(C1A2)
L_AO_0_P: A0-A1.3(+IN_A) ANALOG_PORT.1
L_AO_1: A0-A1.7(OUT_B) BOARD1.D35 D2.3(C1A2)
L_AO_1_P: A0-A1.5(+IN_B) ANALOG_PORT.2
L_AO_2: A2-A3.1(OUT_A) BOARD2.D34 D3.3(C1A2)
L_AO_2_P: A2-A3.3(+IN_A) ANALOG_PORT.3
L_AO_3: A2-A3.7(OUT_B) BOARD2.D35 D4.3(C1A2)
L_AO_3_P: A2-A3.5(+IN_B) ANALOG_PORT.4
L_AO_4: A4-A5.1(OUT_A) BOARD3.D34 D5.3(C1A2)
L_AO_4_P: A4-A5.3(+IN_A) ANALOG_PORT.5
L_AO_5: A4-A5.7(OUT_B) BOARD3.D35 D6.3(C1A2)
L_AO_5_P: A4-A5.5(+IN_B) ANALOG_PORT.6
L_AO_6: A6-A7.1(OUT_A) BOARD4.D34 D7.3(C1A2)
L_AO_6_P: A6-A7.3(+IN_A) ANALOG_PORT.7
L_AO_7: A6-A7.7(OUT_B) BOARD4.D35 D8.3(C1A2)
L_AO_7_P: A6-A7.5(+IN_B) ANALOG_PORT.8
L_AO_8: A8-A9.1(OUT_A) BOARD5.D34 D9.3(C1A2)
L_AO_8_P: A8-A9.3(+IN_A) ANALOG_PORT.9
L_AO_9: A8-A9.7(OUT_B) BOARD5.D35 D10.3(C1A2)
L_AO_9_P: A8-A9.5(+IN_B) ANALOG_PORT.10
L_AO_10: A10-A11.1(OUT_A) BOARD6.D34 D11.3(C1A2)
L_AO_10_P: A10-A11.3(+IN_A) ANALOG_PORT.11
L_AO_11: A10-A11.7(OUT_B) BOARD6.D35 D12.3(C1A2)
L_AO_11_P: A10-A11.5(+IN_B) ANALOG_PORT.12
L_AO_12: A12-A13.1(OUT_A) BOARD7.D34 D13.3(C1A2)
L_AO_12_P: A12-A13.3(+IN_A) ANALOG_PORT.13
L_AO_13: A12-A13.7(OUT_B) BOARD7.D35 D14.3(C1A2)
L_AO_13_P: A12-A13.5(+IN_B) ANALOG_PORT.14
L_AO_14: A14-A15.1(OUT_A) BOARD8.D34 D15.3(C1A2)
L_AO_14_P: A14-A15.3(+IN_A) ANALOG_PORT.15
L_AO_15: A14-A15.7(OUT_B) BOARD8.D35 D16.3(C1A2)
L_AO_15_P: A14-A15.5(+IN_B) ANALOG_PORT.16
L_DI_0: BOARD1.D12 U4.2(A1)
L_DI_0_P: PORT-DIGITAL.A1 U4.18(B1)
L_DI_1: BOARD1.D14 U2.2(A1)
L_DI_1_P: PORT-DIGITAL.A20 U2.18(B1)
L_DI_2: BOARD2.D12 U4.3(A2)
L_DI_2_P: PORT-DIGITAL.A2 U4.17(B2)
L_DI_3: BOARD2.D14 U2.3(A2)
L_DI_3_P: PORT-DIGITAL.A21 U2.17(B2)
L_DI_4: BOARD3.D12 U4.4(A3)
L_DI_4_P: PORT-DIGITAL.A3 U4.16(B3)
L_DI_5: BOARD3.D14 U2.4(A3)
L_DI_5_P: PORT-DIGITAL.A22 U2.16(B3)
L_DI_6: BOARD4.D12 U4.5(A4)
L_DI_6_P: PORT-DIGITAL.A4 U4.15(B4)
L_DI_7: BOARD4.D14 U2.5(A4)
L_DI_7_P: PORT-DIGITAL.A23 U2.15(B4)
L_DI_8: BOARD5.D12 U2.6(A5)
L_DI_8_P: PORT-DIGITAL.A24 U2.14(B5)
L_DI_9: BOARD5.D14 U4.6(A5)
L_DI_9_P: PORT-DIGITAL.A6 U4.14(B5)
L_DI_10: BOARD6.D12 U2.7(A6)
L_DI_10_P: PORT-DIGITAL.A25 U2.13(B6)
L_DI_11: BOARD6.D14 U4.7(A6)
L_DI_11_P: PORT-DIGITAL.A7 U4.13(B6)
L_DI_012: BOARD7.D12 U2.8(A7)
L_DI_12_P: PORT-DIGITAL.A26 U2.12(B7)
L_DI_13: BOARD7.D14 U4.8(A7)
L_DI_13_P: PORT-DIGITAL.A8 U4.12(B7)
L_DI_014: BOARD8.D12 U2.9(A8)
L_DI_14_P: PORT-DIGITAL.A27 U2.11(B8)
L_DI_015: BOARD8.D14 U4.9(A8)
L_DI_15_P: PORT-DIGITAL.A9 U4.11(B8)
L_GROUND: A0-A1.2(-IN_A) A0-A1.4(V-) A0-A1.6(-IN_B) A2-A3.2(-IN_A) A2-A3.4(V-) A2-A3.6(-IN_B) A4-A5.2(-IN_A) A4-A5.4(V-) A4-A5.6(-IN_B) A6-A7.2(-IN_A) A6-A7.4(V-) A6-A7.6(-IN_B) A8-A9.2(-IN_A) A8-A9.4(V-) A8-A9.6(-IN_B) A10-A11.2(-IN_A) A10-A11.4(V-) A10-A11.6(-IN_B) A12-A13.2(-IN_A) A12-A13.4(V-) A12-A13.6(-IN_B) A14-A15.2(-IN_A) A14-A15.4(V-) A14-A15.6(-IN_B) ANALOG_PORT.20 ANALOG_PORT.21 ANALOG_PORT.22 ANALOG_PORT.23 ANALOG_PORT.24 ANALOG_PORT.25 ANALOG_PORT.26 ANALOG_PORT.27 ANALOG_PORT.28 ANALOG_PORT.29 ANALOG_PORT.30 ANALOG_PORT.31 ANALOG_PORT.32 ANALOG_PORT.33 ANALOG_PORT.34 ANALOG_PORT.35 ANALOG_PORT.37 BOARD1.GND BOARD2.GND BOARD3.GND BOARD4.GND BOARD5.GND BOARD6.GND BOARD7.GND BOARD8.GND BOARD9.GND C1.- C2.- C3.2 C4.2 C5.2 C6.2 C7.2 C9.- C11.2 D1.1(A1) D2.1(A1) D3.1(A1) D4.1(A1) D5.1(A1) D6.1(A1) D7.1(A1) D8.1(A1) D9.1(A1) D10.1(A1) D11.1(A1) D12.1(A1) D13.1(A1) D14.1(A1) D15.1(A1) D16.1(A1) D19.A FT232LB.9 FT232LB.18 PORT-DIGITAL.A5 PORT-DIGITAL.A14 PORT-DIGITAL.A28 PORT-DIGITAL.A37 Q1.1(K) R2.1 R30.2 R31.2 R32.2 U2.10(GND) U2.19(!OE) U4.10(GND) U4.19(!OE) X1.6(GND) ; supply symbol labelled GND
L_SCL: BOARD1.D22 BOARD2.D22 BOARD3.D22 BOARD4.D22 BOARD5.D22 BOARD6.D22 BOARD7.D22 BOARD8.D22 BOARD9.D22
L_SDA: BOARD1.D21 BOARD2.D21 BOARD3.D21 BOARD4.D21 BOARD5.D21 BOARD6.D21 BOARD7.D21 BOARD8.D21 BOARD9.D21
N$1: C1.+ IC2.3(INPUT) LD1_MOD10.A SWITCH_3V3.2(P)
N$2: BOARD7.3V3 MCP2515_MOD7.1
N$3: IC2.1(ADJUST) R1.1 R2.2
N$4: LD1_MOD11.K(C) R31.1
N$5: C4.1 D17.A Q1.3(G) R32.1
N$6: BOARD9.D23 MCP2515_MOD9.5
N$7: BOARD9.D19 MCP2515_MOD9.4
N$8: LD1_MOD10.K(C) R30.1
N$9: C3.1 D17.C D18.A D19.C FUSE.2A LD1_MOD11.A Q1.2(A)
N$10: FUSE.1A SWITCH_GENERAL.2(P)
N$11: J1.F1(A:F1)
N$22: BOARD1.D23 MCP2515_MOD1.5
N$23: BOARD1.D19 MCP2515_MOD1.4
N$24: BOARD1.D18 MCP2515_MOD1.6
N$25: BOARD1.3V3 MCP2515_MOD1.1
N$27: BOARD9.3V3 MCP2515_MOD9.1
N$28: BOARD9.D18 MCP2515_MOD9.6
N$29: BOARD9.D2 MCP2515_MOD9.3
N$30: LD1_MOD2.A R6.2
N$31: BOARD1.D2 MCP2515_MOD1.3
N$32: BOARD2.D18 MCP2515_MOD2.6
N$33: BOARD2.D23 MCP2515_MOD2.5
N$34: BOARD2.D19 MCP2515_MOD2.4
N$35: BOARD2.3V3 MCP2515_MOD2.1
N$36: LD1_MOD4.A R12.2
N$37: BOARD2.D2 MCP2515_MOD2.3
N$38: BOARD3.D23 MCP2515_MOD3.5
N$39: BOARD3.D18 MCP2515_MOD3.6
N$40: BOARD3.D19 MCP2515_MOD3.4
N$41: BOARD3.3V3 MCP2515_MOD3.1
N$42: LD2_MOD4.A R13.2
N$43: BOARD3.D2 MCP2515_MOD3.3
N$44: BOARD4.D18 MCP2515_MOD4.6
N$45: BOARD4.D23 MCP2515_MOD4.5
N$46: BOARD4.D19 MCP2515_MOD4.4
N$47: BOARD4.3V3 MCP2515_MOD4.1
N$48: BOARD4.D27 R14.1
N$49: BOARD4.D2 MCP2515_MOD4.3
N$51: LD1_MOD1.A R3.2
N$52: BOARD5.D18 MCP2515_MOD5.6
N$53: BOARD5.D23 MCP2515_MOD5.5
N$54: BOARD5.D19 MCP2515_MOD5.4
N$55: BOARD5.3V3 MCP2515_MOD5.1
N$56: LD1_MOD9.A R27.2
N$57: BOARD5.D2 MCP2515_MOD5.3
N$58: BOARD6.D18 MCP2515_MOD6.6
N$59: BOARD6.D23 MCP2515_MOD6.5
N$60: BOARD6.D19 MCP2515_MOD6.4
N$61: BOARD6.3V3 MCP2515_MOD6.1
N$62: LD2_MOD9.A R28.2
N$63: BOARD6.D2 MCP2515_MOD6.3
N$64: BOARD7.D18 MCP2515_MOD7.6
N$65: BOARD7.D23 MCP2515_MOD7.5
N$66: BOARD7.D19 MCP2515_MOD7.4
N$67: LD3_MOD9.A R29.2
N$68: BOARD7.D2 MCP2515_MOD7.3
N$69: BOARD8.D18 MCP2515_MOD8.6
N$70: BOARD8.D23 MCP2515_MOD8.5
N$71: BOARD8.D19 MCP2515_MOD8.4
N$72: BOARD8.3V3 MCP2515_MOD8.1
N$73: BOARD9.D27 R29.1
N$74: BOARD8.D2 MCP2515_MOD8.3
N$75: LD2_MOD1.A R4.2
N$76: LD3_MOD1.A R5.2
N$77: BOARD1.D27 R5.1
N$78: BOARD1.D26 R4.1
N$79: BOARD1.D25 R3.1
N$80: LD2_MOD2.A R7.2
N$81: LD3_MOD2.A R8.2
N$82: BOARD2.D27 R8.1
N$83: BOARD2.D26 R7.1
N$84: BOARD2.D25 R6.1
N$85: LD1_MOD3.A R9.2
N$86: LD2_MOD3.A R10.2
N$87: LD3_MOD3.A R11.2
N$88: LD3_MOD4.A R14.2
N$89: BOARD4.D26 R13.1
N$90: BOARD4.D25 R12.1
N$91: BOARD3.D27 R11.1
N$92: BOARD3.D26 R10.1
N$93: BOARD3.D25 R9.1
N$94: LD1_MOD5.A R15.2
N$95: LD2_MOD5.A R16.2
N$96: LD3_MOD5.A R17.2
N$97: BOARD5.D27 R17.1
N$98: BOARD5.D26 R16.1
N$99: BOARD5.D25 R15.1
N$100: LD1_MOD6.A R18.2
N$101: LD2_MOD6.A R19.2
N$102: LD3_MOD6.A R20.2
N$103: BOARD6.D27 R20.1
N$104: BOARD6.D26 R19.1
N$105: BOARD6.D25 R18.1
N$106: LD1_MOD7.A R21.2
N$107: LD2_MOD7.A R22.2
N$108: LD3_MOD7.A R23.2
N$109: BOARD7.D27 R23.1
N$110: BOARD7.D26 R22.1
N$111: BOARD7.D25 R21.1
N$112: LD1_MOD8.A R24.2
N$113: LD2_MOD8.A R25.2
N$114: LD3_MOD8.A R26.2
N$115: BOARD8.D27 R26.1
N$116: BOARD8.D26 R25.1
N$117: BOARD8.D25 R24.1
N$118: BOARD9.D26 R28.1
N$119: BOARD9.D25 R27.1
RX_FT232BL: FT232LB.2 SERIAL_FT232.1
TX_FT232BL: FT232LB.1 SERIAL_FT232.2
U0_RX_MOD1: BOARD1.D3 SERIAL_MOD1.2
U0_RX_MOD2: BOARD2.D3 SERIAL_MOD2.2
U0_RX_MOD3: BOARD3.D3 SERIAL_MOD3.2
U0_RX_MOD4: BOARD4.D3 SERIAL_MOD4.2
U0_RX_MOD5: BOARD5.D3 SERIAL_MOD5.2
U0_RX_MOD6: BOARD6.D3 SERIAL_MOD6.2
U0_RX_MOD7: BOARD7.D3 SERIAL_MOD7.2
U0_RX_MOD8: BOARD8.D3 SERIAL_MOD8.2
U0_RX_MOD9: BOARD9.D3 SERIAL_MOD9.2
U0_TX_MOD1: BOARD1.D1 SERIAL_MOD1.1
U0_TX_MOD2: BOARD2.D1 SERIAL_MOD2.1
U0_TX_MOD3: BOARD3.D1 SERIAL_MOD3.1
U0_TX_MOD4: BOARD4.D1 SERIAL_MOD4.1
U0_TX_MOD5: BOARD5.D1 SERIAL_MOD5.1
U0_TX_MOD6: BOARD6.D1 SERIAL_MOD6.1
U0_TX_MOD7: BOARD7.D1 SERIAL_MOD7.1
U0_TX_MOD8: BOARD8.D1 SERIAL_MOD8.1
U0_TX_MOD9: BOARD9.D1 SERIAL_MOD9.1
U2_RX_MOD9: BOARD9.D16 X1.32(GPIO12)
U2_TX_MOD9: BOARD9.D17 X1.33(GPIO13)
Unconnected: ANALOG_PORT.17 ANALOG_PORT.18 ANALOG_PORT.19 ANALOG_PORT.36 BOARD1.D4 BOARD1.D5 BOARD1.D13 BOARD1.D15 BOARD1.D16 BOARD1.D17 BOARD1.D32 BOARD1.D33 BOARD1.EN BOARD1.VN BOARD1.VP BOARD2.D4 BOARD2.D5 BOARD2.D13 BOARD2.D15 BOARD2.D16 BOARD2.D17 BOARD2.D32 BOARD2.D33 BOARD2.EN BOARD2.VN BOARD2.VP BOARD3.D4 BOARD3.D5 BOARD3.D13 BOARD3.D15 BOARD3.D16 BOARD3.D17 BOARD3.D32 BOARD3.D33 BOARD3.EN BOARD3.VN BOARD3.VP BOARD4.D4 BOARD4.D5 BOARD4.D13 BOARD4.D15 BOARD4.D16 BOARD4.D17 BOARD4.D32 BOARD4.D33 BOARD4.EN BOARD4.VN BOARD4.VP BOARD5.D4 BOARD5.D5 BOARD5.D13 BOARD5.D15 BOARD5.D16 BOARD5.D17 BOARD5.D32 BOARD5.D33 BOARD5.EN BOARD5.VN BOARD5.VP BOARD6.D4 BOARD6.D5 BOARD6.D13 BOARD6.D15 BOARD6.D16 BOARD6.D17 BOARD6.D32 BOARD6.D33 BOARD6.EN BOARD6.VN BOARD6.VP BOARD7.D4 BOARD7.D5 BOARD7.D13 BOARD7.D15 BOARD7.D16 BOARD7.D17 BOARD7.D32 BOARD7.D33 BOARD7.EN BOARD7.VN BOARD7.VP BOARD8.D4 BOARD8.D5 BOARD8.D13 BOARD8.D15 BOARD8.D16 BOARD8.D17 BOARD8.D32 BOARD8.D33 BOARD8.EN BOARD8.VN BOARD8.VP BOARD9.D4 BOARD9.D5 BOARD9.D12 BOARD9.D13 BOARD9.D14 BOARD9.D15 BOARD9.D32 BOARD9.D33 BOARD9.D34 BOARD9.D35 BOARD9.EN BOARD9.VN BOARD9.VP FT232LB.3 FT232LB.4 FT232LB.5 FT232LB.6 FT232LB.7 FT232LB.8 FT232LB.10 FT232LB.11 FT232LB.12 FT232LB.13 FT232LB.14 FT232LB.16 FT232LB.17 J1.1(C:MNT_1) J1.2(C:MNT_2) J1.3(C:MNT_3) J1.4(C:MNT_4) J1.F2(A:F2) J1.F3(A:F3) J1.F4(A:F4) J1.F5(A:F5) J1.F6(A:F6) J1.F7(A:F7) J1.F8(A:F8) J1.F9(A:F9) J1.F10(A:F10) J1.F11(A:F11) J1.F12(A:F12) J1.F13(A:F13) J1.F14(A:F14) J1.F15(A:F15) J1.F16(A:F16) J1.F17(A:F17) J1.F18(A:F18) J1.F19(A:F19) J1.F20(A:F20) J1.F21(A:F21) J1.F22(A:F22) J1.F23(A:F23) J1.F24(A:F24) J1.F25(A:F25) J1.F26(A:F26) J1.F27(A:F27) J1.F28(A:F28) J1.F29(A:F29) J1.F30(A:F30) J1.F31(A:F31) J1.F32(A:F32) J1.F33(A:F33) J1.F34(A:F34) J1.F35(A:F35) J1.F36(A:F36) J1.F37(A:F37) J1.M1(B:M1) J1.M2(B:M2) J1.M3(B:M3) J1.M4(B:M4) J1.M5(B:M5) J1.M6(B:M6) J1.M7(B:M7) J1.M8(B:M8) J1.M9(B:M9) J1.M10(B:M10) J1.M11(B:M11) J1.M12(B:M12) J1.M13(B:M13) J1.M14(B:M14) J1.M15(B:M15) J1.M16(B:M16) J1.M17(B:M17) J1.M18(B:M18) J1.M19(B:M19) J1.M20(B:M20) J1.M21(B:M21) J1.M22(B:M22) J1.M23(B:M23) J1.M24(B:M24) J1.M25(B:M25) J1.M26(B:M26) J1.M27(B:M27) J1.M28(B:M28) J1.M29(B:M29) J1.M30(B:M30) J1.M31(B:M31) J1.M32(B:M32) J1.M33(B:M33) J1.M34(B:M34) J1.M35(B:M35) J1.M36(B:M36) J1.M37(B:M37) MCP2515_MOD1.7 MCP2515_MOD2.7 MCP2515_MOD3.7 MCP2515_MOD4.7 MCP2515_MOD5.7 MCP2515_MOD6.7 MCP2515_MOD7.7 MCP2515_MOD8.7 MCP2515_MOD9.7 PORT-DIGITAL.A10 PORT-DIGITAL.A11 PORT-DIGITAL.A12 PORT-DIGITAL.A13 PORT-DIGITAL.A15 PORT-DIGITAL.A16 PORT-DIGITAL.A17 PORT-DIGITAL.A18 PORT-DIGITAL.A29 PORT-DIGITAL.A30 PORT-DIGITAL.A31 PORT-DIGITAL.A32 PORT-DIGITAL.A33 PORT-DIGITAL.A34 PORT-DIGITAL.A35 PORT-DIGITAL.A36 PORT-DIGITAL.B1 PORT-DIGITAL.B2 PORT-DIGITAL.B3 PORT-DIGITAL.B4 PORT-DIGITAL.B5 PORT-DIGITAL.B6 PORT-DIGITAL.B7 PORT-DIGITAL.B8 PORT-DIGITAL.B9 PORT-DIGITAL.B10 PORT-DIGITAL.B11 PORT-DIGITAL.B12 PORT-DIGITAL.B13 PORT-DIGITAL.B14 PORT-DIGITAL.B15 PORT-DIGITAL.B16 PORT-DIGITAL.B17 PORT-DIGITAL.B18 PORT-DIGITAL.B19 PORT-DIGITAL.B20 PORT-DIGITAL.B21 PORT-DIGITAL.B22 PORT-DIGITAL.B23 PORT-DIGITAL.B24 PORT-DIGITAL.B25 PORT-DIGITAL.B26 PORT-DIGITAL.B27 PORT-DIGITAL.B28 PORT-DIGITAL.B29 PORT-DIGITAL.B30 PORT-DIGITAL.B31 PORT-DIGITAL.B32 PORT-DIGITAL.B33 PORT-DIGITAL.B34 PORT-DIGITAL.B35 PORT-DIGITAL.B36 PORT-DIGITAL.B37 PORT-DIGITAL.MH1 PORT-DIGITAL.MH2 PORT-DIGITAL.MH3 PORT-DIGITAL.MH4 SWITCH_3V3.1(O) SWITCH_GENERAL.1(O) SWITCH_GENERAL.3(S) SWITCH_MOD1.1(O) SWITCH_MOD2.1(O) SWITCH_MOD3.1(O) SWITCH_MOD4.1(O) SWITCH_MOD5.1(O) SWITCH_MOD6.1(O) SWITCH_MOD7.1(O) SWITCH_MOD8.1(O) SWITCH_MOD9.1(O) X1.3(SDA) X1.4(N.C.0) X1.5(SCL) X1.7(GPIO04) X1.8(TXD) X1.9(N.C.1) X1.10(RXD) X1.11(GPIO17) X1.12(GPIO18) X1.13(GPIO27) X1.14(N.C.2) X1.15(GPIO22) X1.16(GPIO23) X1.17(N.C.3) X1.18(GPIO24) X1.19(SPI_MOSI) X1.20(N.C.4) X1.21(SPI_MISO) X1.22(GPIO25) X1.23(SPI_SCLK) X1.24(SPI_CE0) X1.25(N.C.5) X1.26(SPI_CE1) X1.27(ID_SD) X1.28(ID_SC) X1.29(GPIO05) X1.30(N.C.6) X1.31(GPIO06) X1.34(N.C.7) X1.35(GPIO19) X1.36(GPIO16) X1.37(GPIO26) X1.38(GPIO20) X1.39(N.C.8) X1.40(GPIO21)

## Sheet 2 of 2

## Power pins joined to a net without a drawn wire
3V3: X1.1(3V3)
5V0: X1.2(5V0)

## Library data of the parts
A0-A1 A2-A3 A4-A5 A6-A7 A8-A9 A10-A11 A12-A13 A14-A15 = Texas Instruments_By_element14_Batch_1:OPA2350PA: OPERATIONAL AMPLIFIER; MPN: OPA2350PA; OC_FARNELL: 4353316; OC_NEWARK: 75C4730; PACKAGE: PDIP; SUPPLIER: Texas Instruments
ANALOG_PORT = DB37-analog:M37: SUB-D; OC_FARNELL: unknown; OC_NEWARK: unknown
BOARD1-BOARD9 = ESP32-DEVKITV1:ESP32DEVKITV1: https://github.com/shridattdudhat
C1 C2 = resistor:CPOL-US: POLARIZED CAPACITOR, American symbol
C3 C4 C11 = resistor:C-EU: CAPACITOR, European symbol
C5 C6 = capacitor-wima:C: CAPACITOR naming: grid - package width
C7 = rcl:C-EU: CAPACITOR, European symbol; SPICEPREFIX: C
C9 = rcl:CPOL-EU: POLARIZED CAPACITOR, European symbol; SPICEPREFIX: C
D1-D16 = diode:BAT54S: Schottky Diodes Pin connection corrected 2011-05-04 Source: Fairchild .. BAT54.pdf
D17 = diode:ZENER-DIODE: Z-Diode
D18 D19 = diode:SCHOTTKY-DIODE: Schottky Diode
FT232LB = FT232BL:FT232BL: FT232BL MODULE; OC_FARNELL: unknown; OC_NEWARK: unknown
FUSE = fuse:FUSE: Fuse; OC_FARNELL: unknown; OC_NEWARK: unknown
IC2 = SamacSys_Parts:LM317T: Standard Regulator 1.2V to 37V 1.5A STMicroelectronics LM317T, Single Linear Voltage Regulator, 1.5A Adjustable 1.2 37 V, 3-Pin TO-220 Source: Datasheet <http://www.st.com/web/en/resource/technical/document/datasheet/CD00000455.pdf>; DESCRIPTION: Standard Regulator 1.2V to 37V 1.5A STMicroelectronics LM317T, Single Linear Voltage Regulator, 1.5A Adjustable 1.2 37 V, 3-Pin TO-220; HEIGHT: 4.6mm; MANUFACTURER_NAME: STMicroelectronics; MANUFACTURER_PART_NUMBER: LM317T; MOUSER_PART_NUMBER: 511-LM317T; MOUSER_PRICE-STOCK: https://www.mouser.co.uk/ProductDetail/STMicroelectronics/LM317T?qs=swDD%252BF%252Bps7c8uLyY%252B3mJJw%3D%3D
J1 = DB37:ASSMANN_WSW_COMPONENTS_ASUB-277-37TP25: CONN D-SUB PLUG/RCPT 37POS R/A; AUTOMOTIVE: No; CENTROID_NOT_SPECIFIED: No; CONN_ORIENTATION: Right Angle; CONTACT_MATERIAL: Gold,Nickel; CURRENT_RATING: 3A; DATASHEET: http://www.assmann-wsw.com/fileadmin/datasheets/ASS_6549_CO.pdf; DEVICE_CLASS_L1: Connectors; DEVICE_CLASS_L2: D-Sub Connectors; DEVICE_CLASS_L3: unset; DIGIKEY_DESCRIPTION: CONN D-SUB PLUG/RCPT 37POS R/A; DIGIKEY_PART_NUMBER: AE10967-ND; FOOTPRINT_VARIANT_NAME_0: Recommended_Land_Pattern; HEIGHT: 32.05mm; IS_FEMALE: yes; LEAD_FREE: Yes; MF: ASSMANN WSW Components; MFG_PACKAGE_IDENT: 0; MFG_PACKAGE_IDENT_DATE: 0; MFG_PACKAGE_IDENT_REV: 0; MPN: ASUB-277-37TP25; NUMBER_OF_CONTACTS: 74; PACKAGE: CONN_D-SUB37_DUAL; PITCH: 2.77mm; PREFIX: J; ROHS: Yes; SHIELDING: true; TEMPERATURE_RANGE_HIGH: +105°C; TEMPERATURE_RANGE_LOW: -55°C; VERIFICATION_VERSION: 0.0.0.3; VOLTAGE_RATING: 250V
LD1_MOD1-LD1_MOD11 LD2_MOD1-LD2_MOD9 LD3_MOD1-LD3_MOD9 = led:LED: LED OSRAM: - CHIPLED LG R971, LG N971, LY N971, LG Q971, LY Q971, LO R971, LY R971 LH N974, LH R974 LS Q976, LO Q976, LY Q976 LO Q996 - Hyper CHIPLED LW Q18S LB Q993, LB Q99A, LB R99A - SideLED LS A670, LO A670, LY A670, LG A670, LP A670 LB A673, LV A673, LT A673, LW A673 LH A674 LY A675 LS A676, LA A676, LO A676, LY A676, LW A676 LS A679, LY A679, LG A679 - Hyper Micro SIDELED® LS Y876, LA Y876, LO Y876, LY Y876 LT Y87S - SmartLED LW L88C, LW L88S LB L89C, LB L89S, LG L890 LS L89K, LO L89K, LY L89K LS L896, LA L896, LO L896, LY L896 - TOPLED LS T670, LO T670, LY T670, LG T670, LP T670 LSG T670, LSP T670, LSY T670, LOP T670, LYG T670 LG T671, LOG T671, LSG T671 LB T673, LV T673, LT T673, LW T673 LH T674 LS T676, LA T676, LO T676, LY T676, LB T676, LH T676, LSB T676, LW T676 LB T67C, LV T67C, LT T67C, LS T67K, LO T67K, LY T67K, LW E67C LS E67B, LA E67B, LO E67B, LY E67B, LB E67C, LV E67C, LT E67C LW T67C LS T679, LY T679, LG T679 LS T770, LO T770, LY T770, LG T770, LP T770 LB T773, LV T773, LT T773, LW T773 LH T774 LS E675, LA E675, LY E675, LS T675 LS T776, LA T776, LO T776, LY T776, LB T776 LHGB T686 LT T68C, LB T68C - Hyper Mini TOPLED® LB M676 - Mini TOPLED Santana® LG M470 LS M47K, LO M47K, LY M47K Source: http://www.osram.convergy.de/
MCP2515_MOD1-MCP2515_MOD9 = mcp2515:MCP2515: MCP2515 MODULE; OC_FARNELL: unknown; OC_NEWARK: unknown
PORT-DIGITAL = ASUB-277-37TP25:ASUB-277-37TP25: CONN D-SUB PLUG/RCPT 37P R/A SLD Source: Datasheet <https://datasheet.datasheetarchive.com/originals/dk/DKDS-12/220594.pdf>; DESCRIPTION: CONN D-SUB PLUG/RCPT 37P R/A SLD; HEIGHT: 31.55mm; MANUFACTURER_NAME: ASSMANN WSW components GmbH; MANUFACTURER_PART_NUMBER: ASUB-277-37TP25
Q1 = SamacSys_Parts:TYN608RG: STMICROELECTRONICS - TYN608RG - Thyristor, 600 V, 15 mA, 5 A, 8 A, TO-220AB, 3 Pins Source: Datasheet <http://www.st.com/web/en/resource/technical/document/datasheet/CD00002270.pdf>; DESCRIPTION: STMICROELECTRONICS - TYN608RG - Thyristor, 600 V, 15 mA, 5 A, 8 A, TO-220AB, 3 Pins; HEIGHT: 4.6mm; MANUFACTURER_NAME: STMicroelectronics; MANUFACTURER_PART_NUMBER: TYN608RG; MOUSER_PART_NUMBER: 511-TYN608; MOUSER_PRICE-STOCK: https://www.mouser.co.uk/ProductDetail/STMicroelectronics/TYN608RG?qs=nKw3P5Zvyeo6xazhIIbUlQ%3D%3D
R1-R32 = resistor:R-EU_: RESISTOR, European symbol
SERIAL_FT232 SERIAL_MOD1-SERIAL_MOD9 = pinhead:PINHD-1X2: PIN HEADER
SWITCH_3V3 SWITCH_GENERAL SWITCH_MOD1-SWITCH_MOD9 = switch:M9040P: TOGGLE SWITCH Marquardt
U2 U4 = lc245a:SN74LVC245AN; DATASHEET_URL: http://www.ti.com/lit/gpn/SN74LVC245A; DESCRIPTION: Octal Bus Transceiver With 3-State Outputs; FAMILY_NAME: STANDARD TRANSCEIVER; GENERIC_PART_NUMBER: SN74LVC245A; INDUSTRY_STD_PKG_TYPE: PDIP; MANUFACTURER: Texas Instruments; MANUFACTURER_PART_NUMBER: SN74LVC245AN; PACKAGE_DESIGNATOR: N; PIN_COUNT: 20; VENDOR: Texas Instruments
X1 = raspberrypi_bastelstube_v13:RASPI_GPIO_B+: Only the 2x20 header connector, nothing else
X2 = Rasp_board:RASPI_BOARD_B+#: Raspberry Pi GPIO connector with markings for the outer dimensions of the Raspberry Pi board model B+ with different sets of drill holes or mounting pads All pins connected